# Altium schematic sheet Microcontroller.SchDoc
size A; SheetNumber: 5; SheetTotal: 5
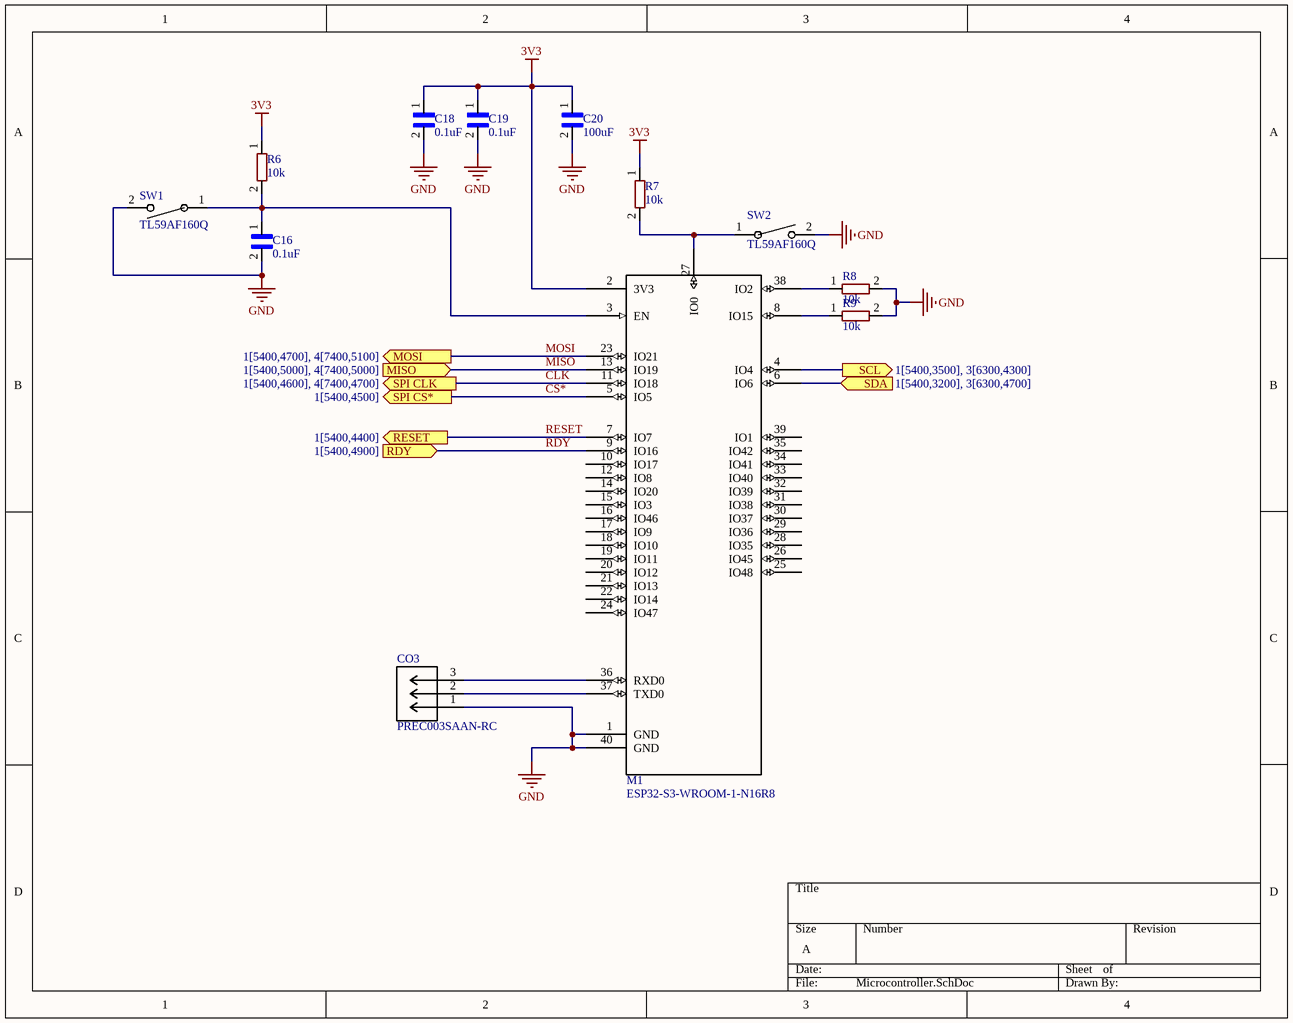
[diagram p0: Microcontroller.SchDoc]

## Parts
C16  0.1uF  [0.1uF Capacitor]
C18  0.1uF  [0.1uF Capacitor]
C19  0.1uF  [0.1uF Capacitor]
C20  100uF  [CAPC3216X190N]
CO3  PREC003SAAN-RC  [CONN_PREC003SAAN-RC_SUL]
M1  ESP32-S3-WROOM-1-N16R8  [ESP32-S3-WROOM-1_EXP]
R6  10k  [0603]
R7  10k  [0603]
R8  10k  [0603]
R9  10k  [0603]
SW1  TL59AF160Q  [SW_TL59AF160Q_EWI]
SW2  TL59AF160Q  [SW_TL59AF160Q_EWI]

## Ports
MISO (in, see 1[5400,5000], 4[7400,5000]), MOSI (out, see 1[5400,4700], 4[7400,5100]), RDY (in, see 1[5400,4900]), RESET (out, see 1[5400,4400]), SCL (out, see 1[5400,3500], 3[6300,4300]), SDA (in, see 1[5400,3200], 3[6300,4700]), SPI CLK (out, see 1[5400,4600], 4[7400,4700]), SPI CS* (out, see 1[5400,4500])

## Nets
3V3: C18.1 C19.1 C20.1 M1.2(3V3) R6.1 R7.1
GND: C16.2 C18.2 C19.2 C20.2 CO3.1 M1.1(GND) M1.40(GND) R8.2 R9.2 SW1.2 SW2.2
CLK: M1.11(IO18) ; port SPI CLK
CS*: M1.5(IO5) ; port SPI CS*
MISO: M1.13(IO19) ; port MISO
MOSI: M1.23(IO21) ; port MOSI
RDY: M1.9(IO16) ; port RDY
RESET: M1.7(IO7) ; port RESET
SCL: M1.4(IO4) ; port SCL
SDA: M1.6(IO6) ; port SDA
NetC16_1: C16.1 M1.3(EN) R6.2 SW1.1
NetCO3_2: CO3.2 M1.37(TXD0)
NetCO3_3: CO3.3 M1.36(RXD0)
NetM1_8: M1.8(IO15) R9.1
NetM1_27: M1.27(IO0) R7.2 SW2.1
NetM1_38: M1.38(IO2) R8.1

Not connected (* = marked no-connect by the designer): M1 10(IO17) 12(IO8) 14(IO20) 15(IO3) 16(IO46) 17(IO9) 18(IO10) 19(IO11) 20(IO12) 21(IO13) 22(IO14) 24(IO47) 25(IO48) 26(IO45) 28(IO35) 29(IO36) 30(IO37) 31(IO38) 32(IO39) 33(IO40) 34(IO41) 35(IO42) 39(IO1)

## Library data of the parts
C16 C18 C19 = CC1206JRX7R9BB104: No Description Available; Mfr_Name: Yageo
C20 = GRM31CR60J107MEA8K: Package: None; Price: None; Value: *; MP: GRM31CR60J107MEA8K; Availability: Unavailable
CO3 = PREC003SAAN-RC: No Description Available; Mfr_Name: Sullins; RefDes: RefDes; Type: Type
M1 = ESP32-S3-WROOM-1-N16R8: No Description Available; Mfr_Name: Espressif Systems; RefDes: RefDes; Type: Type
R6-R9 = RC0603FR-1310KL: http://octopart.com/rc0603fr-1310kl-yageo+%2F+phycomp-25905087; Package: None; Price: None; Value: *; MP: RC0603FR-1310KL; Availability: Unavailable
SW1 SW2 = TL59AF160Q: No Description Available; Mfr_Name: E-Switch